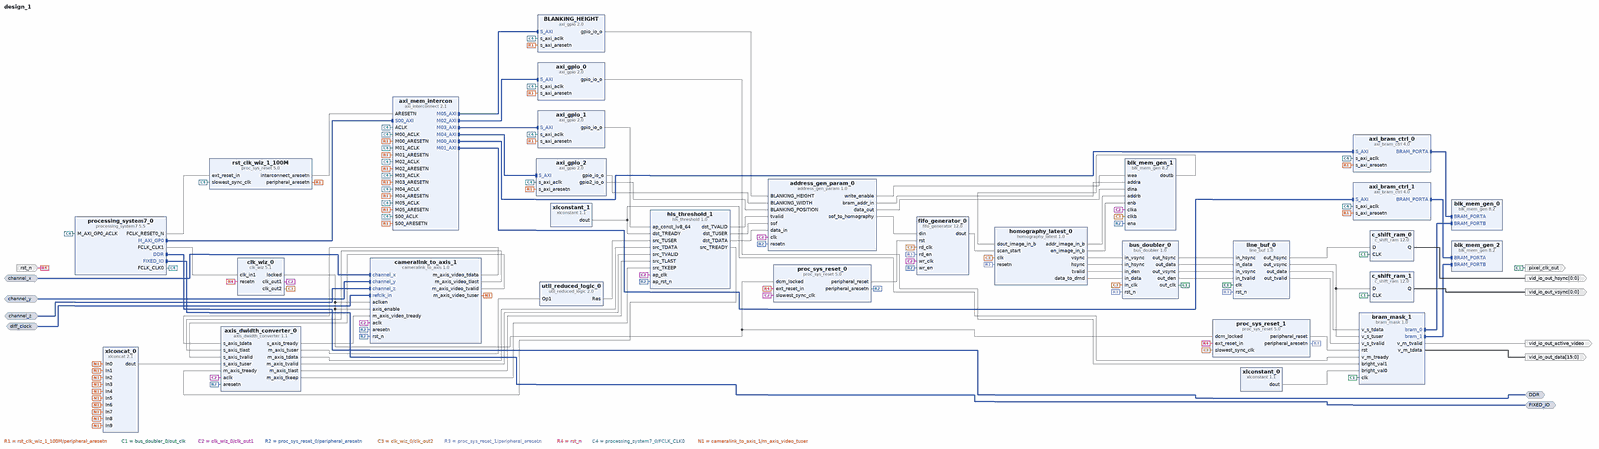
[diagram p0: block diagram of the top level, whole]
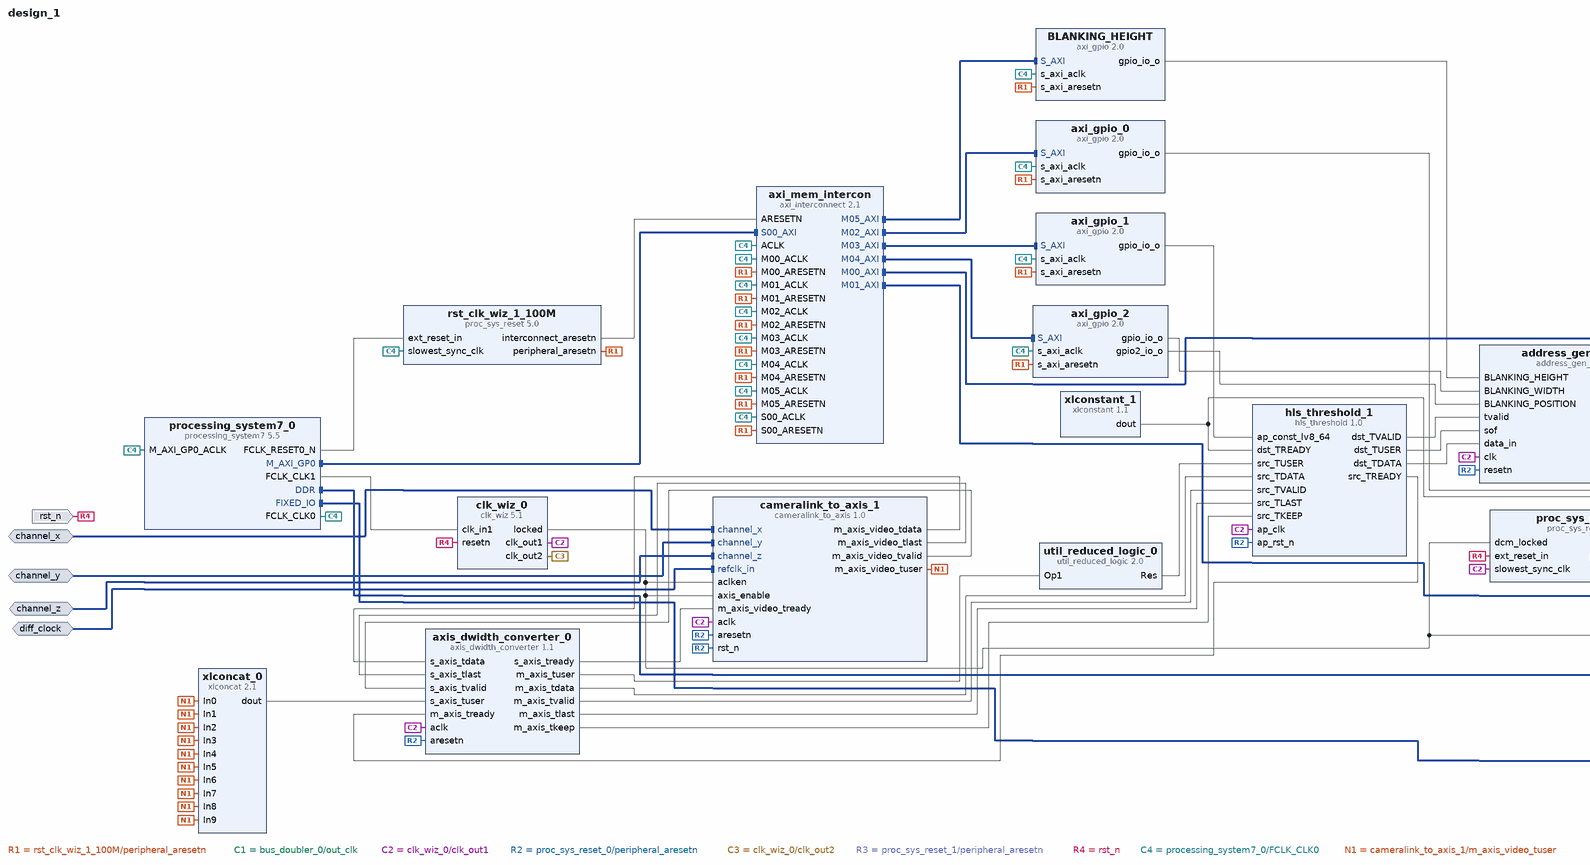
[diagram p1: block diagram of the top level, left part]
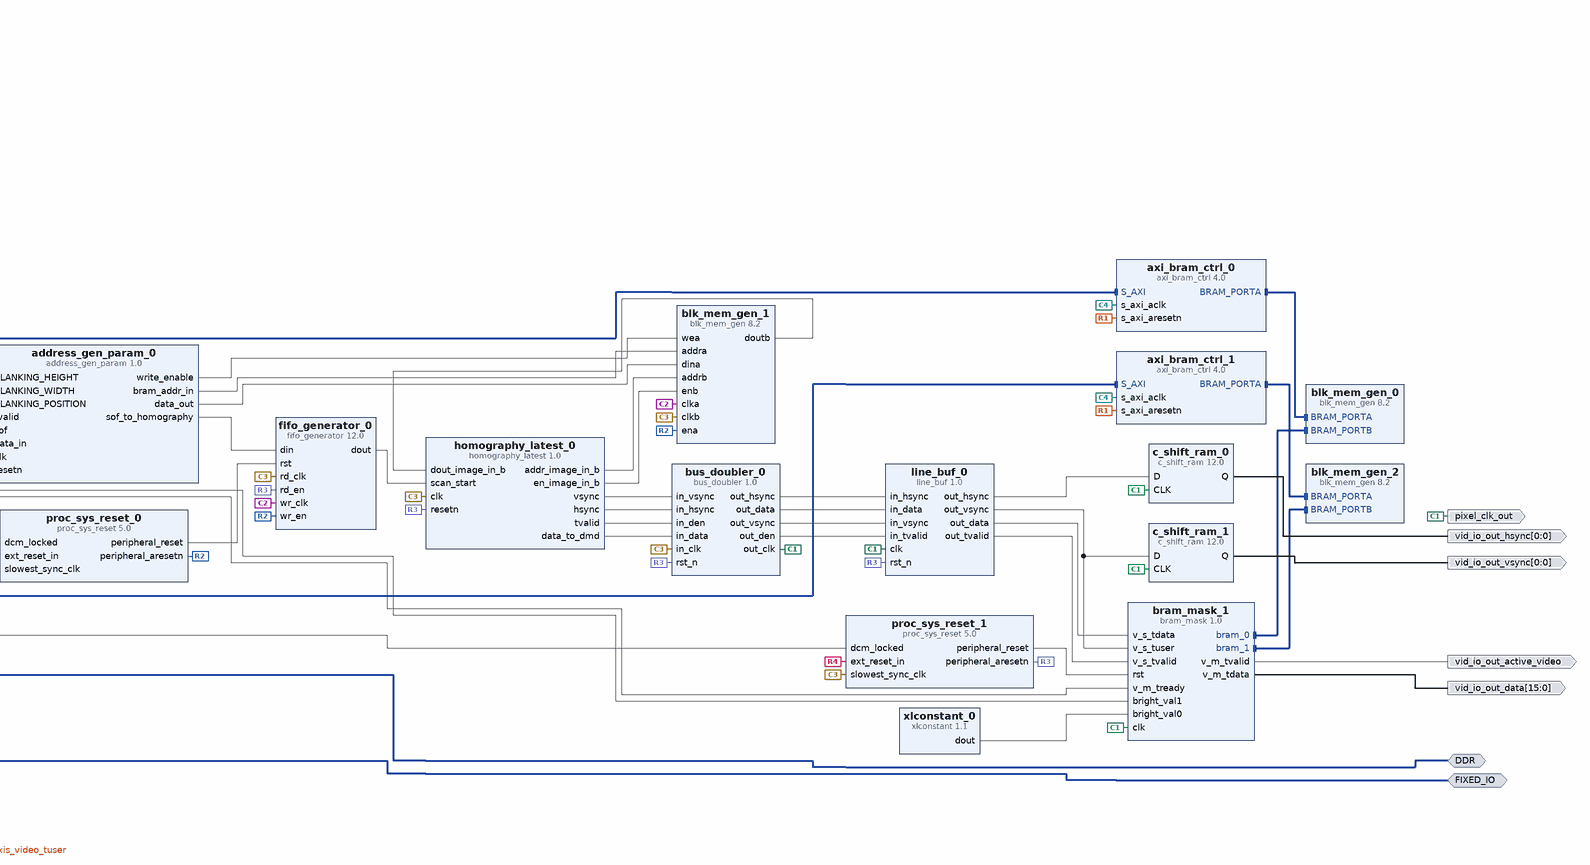
[diagram p2: block diagram of the top level, right part]
# Vivado block design design_1, Vivado 2015.2
create_bd_design design_1

create_bd_intf_port -mode Master -vlnv xilinx.com:interface:ddrx_rtl:1.0 DDR
create_bd_intf_port -mode Master -vlnv xilinx.com:display_processing_system7:fixedio_rtl:1.0 FIXED_IO
create_bd_intf_port -mode Slave -vlnv xilinx.com:interface:channel_link_rtl:1.0 channel_x
create_bd_intf_port -mode Slave -vlnv xilinx.com:interface:channel_link_rtl:1.0 channel_y
create_bd_intf_port -mode Slave -vlnv xilinx.com:interface:channel_link_rtl:1.0 channel_z
create_bd_intf_port -mode Slave -vlnv xilinx.com:interface:diff_clock_rtl:1.0 diff_clock
create_bd_port -dir O -type clk pixel_clk_out
create_bd_port -dir I -type rst rst_n
create_bd_port -dir O -from 0 -to 0 -type data vid_io_out_vsync
create_bd_port -dir O -from 0 -to 0 -type data vid_io_out_hsync
create_bd_port -dir O -from 15 -to 0 vid_io_out_data
create_bd_port -dir O vid_io_out_active_video

create_bd_cell -type ip -vlnv xilinx.com:ip:axi_bram_ctrl:4.0 axi_bram_ctrl_0
set_property -dict {CONFIG.SINGLE_PORT_BRAM 1} [get_bd_cells axi_bram_ctrl_0]
create_bd_cell -type ip -vlnv xilinx.com:ip:axi_bram_ctrl:4.0 axi_bram_ctrl_1
set_property -dict {CONFIG.SINGLE_PORT_BRAM 1} [get_bd_cells axi_bram_ctrl_1]
create_bd_cell -type ip -vlnv xilinx.com:ip:axi_gpio:2.0 axi_gpio_0
set_property -dict {CONFIG.C_GPIO_WIDTH 4 CONFIG.C_ALL_OUTPUTS 1} [get_bd_cells axi_gpio_0]
create_bd_cell -type ip -vlnv xilinx.com:ip:axi_gpio:2.0 axi_gpio_1
set_property -dict {CONFIG.C_GPIO_WIDTH 8 CONFIG.C_DOUT_DEFAULT 0x000000F0 CONFIG.C_ALL_OUTPUTS 1} [get_bd_cells axi_gpio_1]
create_bd_cell -type ip -vlnv xilinx.com:ip:axi_interconnect:2.1 axi_mem_intercon
set_property -dict {CONFIG.NUM_MI 6} [get_bd_cells axi_mem_intercon]
create_bd_cell -type ip -vlnv xilinx.com:ip:axis_dwidth_converter:1.1 axis_dwidth_converter_0
set_property -dict [list \
  CONFIG.S_TDATA_NUM_BYTES 10 \
  CONFIG.M_TDATA_NUM_BYTES 8 \
  CONFIG.TUSER_BITS_PER_BYTE 1 \
  CONFIG.HAS_TLAST 1 \
  CONFIG.HAS_MI_TKEEP 1 \
] [get_bd_cells axis_dwidth_converter_0]
create_bd_cell -type ip -vlnv xilinx.com:ip:blk_mem_gen:8.2 blk_mem_gen_0
set_property -dict [list \
  CONFIG.Memory_Type True_Dual_Port_RAM \
  CONFIG.Enable_B Use_ENB_Pin \
  CONFIG.Use_RSTB_Pin true \
  CONFIG.Port_B_Clock 100 \
  CONFIG.Port_B_Write_Rate 50 \
  CONFIG.Port_B_Enable_Rate 100 \
] [get_bd_cells blk_mem_gen_0]
create_bd_cell -type ip -vlnv xilinx.com:ip:blk_mem_gen:8.2 blk_mem_gen_2
set_property -dict [list \
  CONFIG.Memory_Type True_Dual_Port_RAM \
  CONFIG.Enable_B Use_ENB_Pin \
  CONFIG.Use_RSTB_Pin true \
  CONFIG.Port_B_Clock 100 \
  CONFIG.Port_B_Write_Rate 50 \
  CONFIG.Port_B_Enable_Rate 100 \
] [get_bd_cells blk_mem_gen_2]
create_bd_cell -type ip -vlnv xilinx.com:ip:blk_mem_gen:8.2 blk_mem_gen_1
set_property -dict [list \
  CONFIG.Memory_Type Simple_Dual_Port_RAM \
  CONFIG.Enable_32bit_Address false \
  CONFIG.Use_Byte_Write_Enable false \
  CONFIG.Write_Width_A 8 \
  CONFIG.Operating_Mode_A NO_CHANGE \
  CONFIG.Write_Width_B 8 \
  CONFIG.Read_Width_B 8 \
  CONFIG.Enable_B Use_ENB_Pin \
  CONFIG.Register_PortB_Output_of_Memory_Primitives false \
  CONFIG.Port_B_Clock 100 \
  CONFIG.Port_B_Enable_Rate 100 \
  CONFIG.use_bram_block Stand_Alone \
] [get_bd_cells blk_mem_gen_1]
create_bd_cell -type ip -vlnv user.org:user:bram_mask:1.0 bram_mask_1
create_bd_cell -type ip -vlnv Srihari:user:bus_doubler:1.0 bus_doubler_0
create_bd_cell -type ip -vlnv xilinx.com:ip:c_shift_ram:12.0 c_shift_ram_0
set_property -dict {CONFIG.Width 1 CONFIG.Depth 2 CONFIG.DefaultData 0 CONFIG.AsyncInitVal 0} [get_bd_cells c_shift_ram_0]
create_bd_cell -type ip -vlnv xilinx.com:ip:c_shift_ram:12.0 c_shift_ram_1
set_property -dict {CONFIG.Width 1 CONFIG.Depth 250 CONFIG.DefaultData 0 CONFIG.AsyncInitVal 0} [get_bd_cells c_shift_ram_1]
create_bd_cell -type ip -vlnv Xilinx.com:user:cameralink_to_axis:1.0 cameralink_to_axis_1
create_bd_cell -type ip -vlnv xilinx.com:ip:clk_wiz:5.1 clk_wiz_0
set_property -dict [list \
  CONFIG.PRIMITIVE PLL \
  CONFIG.CLKOUT2_USED true \
  CONFIG.NUM_OUT_CLKS 2 \
  CONFIG.CLKOUT1_REQUESTED_OUT_FREQ 40.625 \
  CONFIG.CLKOUT2_REQUESTED_OUT_FREQ 79 \
  CONFIG.RESET_TYPE ACTIVE_LOW \
  CONFIG.CLKOUT1_JITTER 214.261 \
  CONFIG.CLKOUT1_PHASE_ERROR 317.963 \
  CONFIG.CLKOUT2_JITTER 196.072 \
  CONFIG.CLKOUT2_PHASE_ERROR 317.963 \
] [get_bd_cells clk_wiz_0]
create_bd_cell -type ip -vlnv xilinx.com:ip:fifo_generator:12.0 fifo_generator_0
set_property -dict [list \
  CONFIG.Fifo_Implementation Independent_Clocks_Block_RAM \
  CONFIG.Input_Data_Width 1 \
  CONFIG.Input_Depth 16 \
  CONFIG.Output_Data_Width 1 \
] [get_bd_cells fifo_generator_0]
create_bd_cell -type ip -vlnv Xilinx:user:hls_threshold:1.0 hls_threshold_1
create_bd_cell -type ip -vlnv Srihari:user:line_buf:1.0 line_buf_0
create_bd_cell -type ip -vlnv xilinx.com:ip:proc_sys_reset:5.0 proc_sys_reset_0
create_bd_cell -type ip -vlnv xilinx.com:ip:proc_sys_reset:5.0 proc_sys_reset_1
create_bd_cell -type ip -vlnv xilinx.com:ip:processing_system7:5.5 processing_system7_0
set_property -dict [list \
  CONFIG.PCW_UIPARAM_DDR_FREQ_MHZ 533 \
  CONFIG.PCW_APU_PERIPHERAL_FREQMHZ 666 \
  CONFIG.PCW_SDIO_PERIPHERAL_FREQMHZ 25 \
  CONFIG.PCW_FPGA0_PERIPHERAL_FREQMHZ 100 \
  CONFIG.PCW_FPGA1_PERIPHERAL_FREQMHZ 100 \
  CONFIG.PCW_USE_FABRIC_INTERRUPT 1 \
  CONFIG.PCW_EN_CLK1_PORT 1 \
  CONFIG.PCW_IRQ_F2P_INTR 1 \
  CONFIG.PCW_PRESET_BANK0_VOLTAGE {LVCMOS 2.5V} \
  CONFIG.PCW_PRESET_BANK1_VOLTAGE {LVCMOS 2.5V} \
  CONFIG.PCW_UIPARAM_DDR_PARTNO {MT41K256M16 RE-125} \
  CONFIG.PCW_QSPI_PERIPHERAL_ENABLE 1 \
  CONFIG.PCW_QSPI_GRP_FBCLK_ENABLE 1 \
  CONFIG.PCW_ENET0_PERIPHERAL_ENABLE 1 \
  CONFIG.PCW_ENET0_ENET0_IO {MIO 16 .. 27} \
  CONFIG.PCW_ENET0_GRP_MDIO_ENABLE 1 \
  CONFIG.PCW_ENET_RESET_ENABLE 0 \
  CONFIG.PCW_SD0_PERIPHERAL_ENABLE 1 \
  CONFIG.PCW_UART0_PERIPHERAL_ENABLE 1 \
  CONFIG.PCW_UART0_UART0_IO {MIO 46 .. 47} \
  CONFIG.PCW_WDT_PERIPHERAL_ENABLE 1 \
  CONFIG.PCW_TTC0_PERIPHERAL_ENABLE 1 \
  CONFIG.PCW_USB0_PERIPHERAL_ENABLE 1 \
  CONFIG.PCW_USB_RESET_ENABLE 0 \
  CONFIG.PCW_I2C0_PERIPHERAL_ENABLE 1 \
  CONFIG.PCW_I2C_RESET_ENABLE 0 \
  CONFIG.PCW_GPIO_MIO_GPIO_ENABLE 1 \
] [get_bd_cells processing_system7_0]
# 41 more settings of processing_system7_0 are not shown: defaults, MIO pin electricals, DDR timing, and values the tool derives
create_bd_cell -type ip -vlnv xilinx.com:ip:proc_sys_reset:5.0 rst_clk_wiz_1_100M
create_bd_cell -type ip -vlnv xilinx.com:ip:util_reduced_logic:2.0 util_reduced_logic_0
create_bd_cell -type ip -vlnv xilinx.com:ip:xlconcat:2.1 xlconcat_0
set_property -dict {CONFIG.NUM_PORTS 10} [get_bd_cells xlconcat_0]
create_bd_cell -type ip -vlnv xilinx.com:ip:xlconstant:1.1 xlconstant_0
set_property -dict {CONFIG.CONST_WIDTH 4 CONFIG.CONST_VAL 8} [get_bd_cells xlconstant_0]
create_bd_cell -type ip -vlnv xilinx.com:ip:xlconstant:1.1 xlconstant_1
create_bd_cell -type ip -vlnv xilinx.com:ip:axi_gpio:2.0 axi_gpio_2
set_property -dict [list \
  CONFIG.C_GPIO_WIDTH 4 \
  CONFIG.C_GPIO2_WIDTH 4 \
  CONFIG.C_IS_DUAL 1 \
  CONFIG.C_DOUT_DEFAULT_2 0x00000008 \
  CONFIG.C_DOUT_DEFAULT 0x00000000 \
  CONFIG.C_ALL_OUTPUTS 1 \
  CONFIG.C_ALL_OUTPUTS_2 1 \
] [get_bd_cells axi_gpio_2]
create_bd_cell -type ip -vlnv xilinx.com:ip:axi_gpio:2.0 BLANKING_HEIGHT
set_property -dict {CONFIG.C_GPIO_WIDTH 10 CONFIG.C_DOUT_DEFAULT 0x00000154 CONFIG.C_ALL_OUTPUTS 1} [get_bd_cells BLANKING_HEIGHT]
create_bd_cell -type ip -vlnv Srihari:user:homography_latest:1.0 homography_latest_0
create_bd_cell -type ip -vlnv Srihari:user:address_gen_param:1.0 address_gen_param_0
set_property -dict {CONFIG.START_LINE_FOR_HOMOGRAPHY 19} [get_bd_cells address_gen_param_0]

# ---- connections ----

connect_bd_intf_net [get_bd_intf_pins processing_system7_0/M_AXI_GP0] [get_bd_intf_pins axi_mem_intercon/S00_AXI]
connect_bd_intf_net [get_bd_intf_pins axi_mem_intercon/M00_AXI] [get_bd_intf_pins axi_bram_ctrl_0/S_AXI]
connect_bd_intf_net [get_bd_intf_pins blk_mem_gen_0/BRAM_PORTA] [get_bd_intf_pins axi_bram_ctrl_0/BRAM_PORTA]
connect_bd_intf_net [get_bd_intf_pins axi_bram_ctrl_1/BRAM_PORTA] [get_bd_intf_pins blk_mem_gen_2/BRAM_PORTA]
connect_bd_intf_net [get_bd_intf_pins axi_mem_intercon/M01_AXI] [get_bd_intf_pins axi_bram_ctrl_1/S_AXI]
connect_bd_intf_net [get_bd_intf_pins bram_mask_1/bram_0] [get_bd_intf_pins blk_mem_gen_0/BRAM_PORTB]
connect_bd_intf_net [get_bd_intf_pins blk_mem_gen_2/BRAM_PORTB] [get_bd_intf_pins bram_mask_1/bram_1]
connect_bd_intf_net [get_bd_intf_pins axi_mem_intercon/M02_AXI] [get_bd_intf_pins axi_gpio_0/S_AXI]
connect_bd_intf_net [get_bd_intf_pins axi_mem_intercon/M03_AXI] [get_bd_intf_pins axi_gpio_1/S_AXI]
connect_bd_intf_net [get_bd_intf_pins axi_mem_intercon/M04_AXI] [get_bd_intf_pins axi_gpio_2/S_AXI]
connect_bd_intf_net [get_bd_intf_pins axi_mem_intercon/M05_AXI] [get_bd_intf_pins BLANKING_HEIGHT/S_AXI]
connect_bd_intf_net [get_bd_intf_ports DDR] [get_bd_intf_pins processing_system7_0/DDR]
connect_bd_intf_net [get_bd_intf_ports FIXED_IO] [get_bd_intf_pins processing_system7_0/FIXED_IO]
connect_bd_intf_net [get_bd_intf_ports channel_x] [get_bd_intf_pins cameralink_to_axis_1/channel_x]
connect_bd_intf_net [get_bd_intf_ports channel_y] [get_bd_intf_pins cameralink_to_axis_1/channel_y]
connect_bd_intf_net [get_bd_intf_ports channel_z] [get_bd_intf_pins cameralink_to_axis_1/channel_z]
connect_bd_intf_net [get_bd_intf_ports diff_clock] [get_bd_intf_pins cameralink_to_axis_1/refclk_in]
connect_bd_net [get_bd_pins rst_clk_wiz_1_100M/peripheral_aresetn] \
  [get_bd_pins axi_bram_ctrl_0/s_axi_aresetn] [get_bd_pins axi_bram_ctrl_1/s_axi_aresetn] \
  [get_bd_pins axi_gpio_0/s_axi_aresetn] [get_bd_pins axi_gpio_1/s_axi_aresetn] [get_bd_pins axi_gpio_2/s_axi_aresetn] \
  [get_bd_pins axi_mem_intercon/S00_ARESETN] [get_bd_pins axi_mem_intercon/M00_ARESETN] \
  [get_bd_pins axi_mem_intercon/M01_ARESETN] [get_bd_pins axi_mem_intercon/M02_ARESETN] \
  [get_bd_pins axi_mem_intercon/M03_ARESETN] [get_bd_pins axi_mem_intercon/M04_ARESETN] \
  [get_bd_pins BLANKING_HEIGHT/s_axi_aresetn] [get_bd_pins axi_mem_intercon/M05_ARESETN]
connect_bd_net [get_bd_pins processing_system7_0/FCLK_RESET0_N] [get_bd_pins rst_clk_wiz_1_100M/ext_reset_in]
connect_bd_net [get_bd_pins rst_clk_wiz_1_100M/interconnect_aresetn] [get_bd_pins axi_mem_intercon/ARESETN]
connect_bd_net [get_bd_pins xlconcat_0/dout] [get_bd_pins axis_dwidth_converter_0/s_axis_tuser]
connect_bd_net [get_bd_pins axis_dwidth_converter_0/s_axis_tready] [get_bd_pins cameralink_to_axis_1/m_axis_video_tready]
connect_bd_net [get_bd_pins axis_dwidth_converter_0/m_axis_tuser] [get_bd_pins util_reduced_logic_0/Op1]
connect_bd_net [get_bd_pins address_gen_param_0/write_enable] [get_bd_pins blk_mem_gen_1/wea]
connect_bd_net [get_bd_pins address_gen_param_0/bram_addr_in] [get_bd_pins blk_mem_gen_1/addra]
connect_bd_net [get_bd_pins address_gen_param_0/data_out] [get_bd_pins blk_mem_gen_1/dina]
connect_bd_net [get_bd_pins address_gen_param_0/sof_to_homography] [get_bd_pins fifo_generator_0/din]
connect_bd_net [get_bd_pins homography_latest_0/addr_image_in_b] [get_bd_pins blk_mem_gen_1/addrb]
connect_bd_net [get_bd_pins homography_latest_0/en_image_in_b] [get_bd_pins blk_mem_gen_1/enb]
connect_bd_net [get_bd_pins blk_mem_gen_1/doutb] [get_bd_pins homography_latest_0/dout_image_in_b]
connect_bd_net [get_bd_pins fifo_generator_0/dout] [get_bd_pins homography_latest_0/scan_start]
connect_bd_net [get_bd_pins homography_latest_0/vsync] [get_bd_pins bus_doubler_0/in_vsync]
connect_bd_net [get_bd_pins homography_latest_0/hsync] [get_bd_pins bus_doubler_0/in_hsync]
connect_bd_net [get_bd_pins homography_latest_0/tvalid] [get_bd_pins bus_doubler_0/in_den]
connect_bd_net [get_bd_pins homography_latest_0/data_to_dmd] [get_bd_pins bus_doubler_0/in_data]
connect_bd_net [get_bd_pins bus_doubler_0/out_clk] \
  [get_bd_ports pixel_clk_out] [get_bd_pins bram_mask_1/clk] [get_bd_pins c_shift_ram_0/CLK] [get_bd_pins c_shift_ram_1/CLK] \
  [get_bd_pins line_buf_0/clk]
connect_bd_net [get_bd_pins bus_doubler_0/out_hsync] [get_bd_pins line_buf_0/in_hsync]
connect_bd_net [get_bd_pins bus_doubler_0/out_data] [get_bd_pins line_buf_0/in_data]
connect_bd_net [get_bd_pins bus_doubler_0/out_vsync] [get_bd_pins line_buf_0/in_vsync]
connect_bd_net [get_bd_pins bus_doubler_0/out_den] [get_bd_pins line_buf_0/in_tvalid]
connect_bd_net [get_bd_pins xlconstant_1/dout] [get_bd_pins bram_mask_1/v_m_tready] [get_bd_pins hls_threshold_1/dst_TREADY]
connect_bd_net [get_bd_pins line_buf_0/out_hsync] [get_bd_pins c_shift_ram_0/D]
connect_bd_net [get_bd_pins line_buf_0/out_vsync] [get_bd_pins bram_mask_1/v_s_tuser] [get_bd_pins c_shift_ram_1/D]
connect_bd_net [get_bd_pins processing_system7_0/FCLK_CLK1] [get_bd_pins clk_wiz_0/clk_in1]
connect_bd_net [get_bd_pins clk_wiz_0/clk_out1] \
  [get_bd_pins axis_dwidth_converter_0/aclk] [get_bd_pins blk_mem_gen_1/clka] [get_bd_pins cameralink_to_axis_1/aclk] \
  [get_bd_pins fifo_generator_0/wr_clk] [get_bd_pins hls_threshold_1/ap_clk] [get_bd_pins proc_sys_reset_0/slowest_sync_clk] \
  [get_bd_pins address_gen_param_0/clk]
connect_bd_net [get_bd_pins clk_wiz_0/locked] \
  [get_bd_pins cameralink_to_axis_1/aclken] [get_bd_pins cameralink_to_axis_1/axis_enable] \
  [get_bd_pins proc_sys_reset_0/dcm_locked] [get_bd_pins proc_sys_reset_1/dcm_locked]
connect_bd_net [get_bd_pins proc_sys_reset_0/peripheral_aresetn] \
  [get_bd_pins axis_dwidth_converter_0/aresetn] [get_bd_pins blk_mem_gen_1/ena] [get_bd_pins cameralink_to_axis_1/rst_n] \
  [get_bd_pins cameralink_to_axis_1/aresetn] [get_bd_pins fifo_generator_0/wr_en] [get_bd_pins hls_threshold_1/ap_rst_n] \
  [get_bd_pins address_gen_param_0/resetn]
connect_bd_net [get_bd_pins proc_sys_reset_0/peripheral_reset] [get_bd_pins fifo_generator_0/rst]
connect_bd_net [get_bd_pins clk_wiz_0/clk_out2] \
  [get_bd_pins blk_mem_gen_1/clkb] [get_bd_pins bus_doubler_0/in_clk] [get_bd_pins fifo_generator_0/rd_clk] \
  [get_bd_pins proc_sys_reset_1/slowest_sync_clk] [get_bd_pins homography_latest_0/clk]
connect_bd_net [get_bd_pins proc_sys_reset_1/peripheral_aresetn] \
  [get_bd_pins bus_doubler_0/rst_n] [get_bd_pins fifo_generator_0/rd_en] [get_bd_pins line_buf_0/rst_n] \
  [get_bd_pins homography_latest_0/resetn]
connect_bd_net -net rst_in_1 [get_bd_ports rst_n] \
  [get_bd_pins clk_wiz_0/resetn] [get_bd_pins proc_sys_reset_0/ext_reset_in] [get_bd_pins proc_sys_reset_1/ext_reset_in]
connect_bd_net [get_bd_pins processing_system7_0/FCLK_CLK0] \
  [get_bd_pins axi_bram_ctrl_0/s_axi_aclk] [get_bd_pins axi_bram_ctrl_1/s_axi_aclk] [get_bd_pins axi_gpio_0/s_axi_aclk] \
  [get_bd_pins axi_gpio_1/s_axi_aclk] [get_bd_pins processing_system7_0/M_AXI_GP0_ACLK] \
  [get_bd_pins rst_clk_wiz_1_100M/slowest_sync_clk] [get_bd_pins axi_gpio_2/s_axi_aclk] [get_bd_pins axi_mem_intercon/ACLK] \
  [get_bd_pins axi_mem_intercon/S00_ACLK] [get_bd_pins axi_mem_intercon/M00_ACLK] [get_bd_pins axi_mem_intercon/M01_ACLK] \
  [get_bd_pins axi_mem_intercon/M02_ACLK] [get_bd_pins axi_mem_intercon/M03_ACLK] [get_bd_pins axi_mem_intercon/M04_ACLK] \
  [get_bd_pins BLANKING_HEIGHT/s_axi_aclk] [get_bd_pins axi_mem_intercon/M05_ACLK]
connect_bd_net [get_bd_pins line_buf_0/out_data] [get_bd_pins bram_mask_1/v_s_tdata]
connect_bd_net [get_bd_pins line_buf_0/out_tvalid] [get_bd_pins bram_mask_1/v_s_tvalid]
connect_bd_net [get_bd_pins proc_sys_reset_1/peripheral_reset] [get_bd_pins bram_mask_1/rst]
connect_bd_net [get_bd_pins c_shift_ram_1/Q] [get_bd_ports vid_io_out_vsync]
connect_bd_net [get_bd_pins c_shift_ram_0/Q] [get_bd_ports vid_io_out_hsync]
connect_bd_net [get_bd_pins cameralink_to_axis_1/m_axis_video_tdata] [get_bd_pins axis_dwidth_converter_0/s_axis_tdata]
connect_bd_net [get_bd_pins cameralink_to_axis_1/m_axis_video_tlast] [get_bd_pins axis_dwidth_converter_0/s_axis_tlast]
connect_bd_net [get_bd_pins cameralink_to_axis_1/m_axis_video_tuser] \
  [get_bd_pins xlconcat_0/In0] [get_bd_pins xlconcat_0/In1] [get_bd_pins xlconcat_0/In2] [get_bd_pins xlconcat_0/In3] \
  [get_bd_pins xlconcat_0/In4] [get_bd_pins xlconcat_0/In5] [get_bd_pins xlconcat_0/In6] [get_bd_pins xlconcat_0/In7] \
  [get_bd_pins xlconcat_0/In8] [get_bd_pins xlconcat_0/In9]
connect_bd_net [get_bd_pins cameralink_to_axis_1/m_axis_video_tvalid] [get_bd_pins axis_dwidth_converter_0/s_axis_tvalid]
connect_bd_net [get_bd_pins bram_mask_1/v_m_tdata] [get_bd_ports vid_io_out_data]
connect_bd_net [get_bd_pins bram_mask_1/v_m_tvalid] [get_bd_ports vid_io_out_active_video]
connect_bd_net [get_bd_pins xlconstant_0/dout] [get_bd_pins bram_mask_1/bright_val0]
connect_bd_net [get_bd_pins axi_gpio_0/gpio_io_o] [get_bd_pins bram_mask_1/bright_val1]
connect_bd_net [get_bd_pins axis_dwidth_converter_0/m_axis_tdata] [get_bd_pins hls_threshold_1/src_TDATA]
connect_bd_net [get_bd_pins util_reduced_logic_0/Res] [get_bd_pins hls_threshold_1/src_TUSER]
connect_bd_net [get_bd_pins axis_dwidth_converter_0/m_axis_tvalid] [get_bd_pins hls_threshold_1/src_TVALID]
connect_bd_net [get_bd_pins hls_threshold_1/src_TREADY] [get_bd_pins axis_dwidth_converter_0/m_axis_tready]
connect_bd_net [get_bd_pins axis_dwidth_converter_0/m_axis_tlast] [get_bd_pins hls_threshold_1/src_TLAST]
connect_bd_net [get_bd_pins axis_dwidth_converter_0/m_axis_tkeep] [get_bd_pins hls_threshold_1/src_TKEEP]
connect_bd_net [get_bd_pins hls_threshold_1/dst_TVALID] [get_bd_pins address_gen_param_0/tvalid]
connect_bd_net [get_bd_pins hls_threshold_1/dst_TUSER] [get_bd_pins address_gen_param_0/sof]
connect_bd_net [get_bd_pins hls_threshold_1/dst_TDATA] [get_bd_pins address_gen_param_0/data_in]
connect_bd_net [get_bd_pins axi_gpio_1/gpio_io_o] [get_bd_pins hls_threshold_1/ap_const_lv8_64]
connect_bd_net [get_bd_pins axi_gpio_2/gpio_io_o] [get_bd_pins address_gen_param_0/BLANKING_WIDTH]
connect_bd_net [get_bd_pins axi_gpio_2/gpio2_io_o] [get_bd_pins address_gen_param_0/BLANKING_POSITION]
connect_bd_net [get_bd_pins BLANKING_HEIGHT/gpio_io_o] [get_bd_pins address_gen_param_0/BLANKING_HEIGHT]

# ---- address map ----
assign_bd_address -offset 0x40000000 -range 128K -target_address_space [get_bd_addr_spaces processing_system7_0/Data] [get_bd_addr_segs axi_bram_ctrl_0/S_AXI/Mem0]
assign_bd_address -offset 0x41200000 -range 64K -target_address_space [get_bd_addr_spaces processing_system7_0/Data] [get_bd_addr_segs axi_gpio_0/S_AXI/Reg]
assign_bd_address -offset 0x41210000 -range 64K -target_address_space [get_bd_addr_spaces processing_system7_0/Data] [get_bd_addr_segs axi_gpio_1/S_AXI/Reg]
assign_bd_address -offset 0x41220000 -range 64K -target_address_space [get_bd_addr_spaces processing_system7_0/Data] [get_bd_addr_segs axi_gpio_2/S_AXI/Reg]
assign_bd_address -offset 0x41230000 -range 64K -target_address_space [get_bd_addr_spaces processing_system7_0/Data] [get_bd_addr_segs BLANKING_HEIGHT/S_AXI/Reg]
assign_bd_address -offset 0x42000000 -range 128K -target_address_space [get_bd_addr_spaces processing_system7_0/Data] [get_bd_addr_segs axi_bram_ctrl_1/S_AXI/Mem0]

validate_bd_design
save_bd_design
